# EAGLE schematic schmequencer (EAGLE 9.6.2)

## Sheet 1 of 3
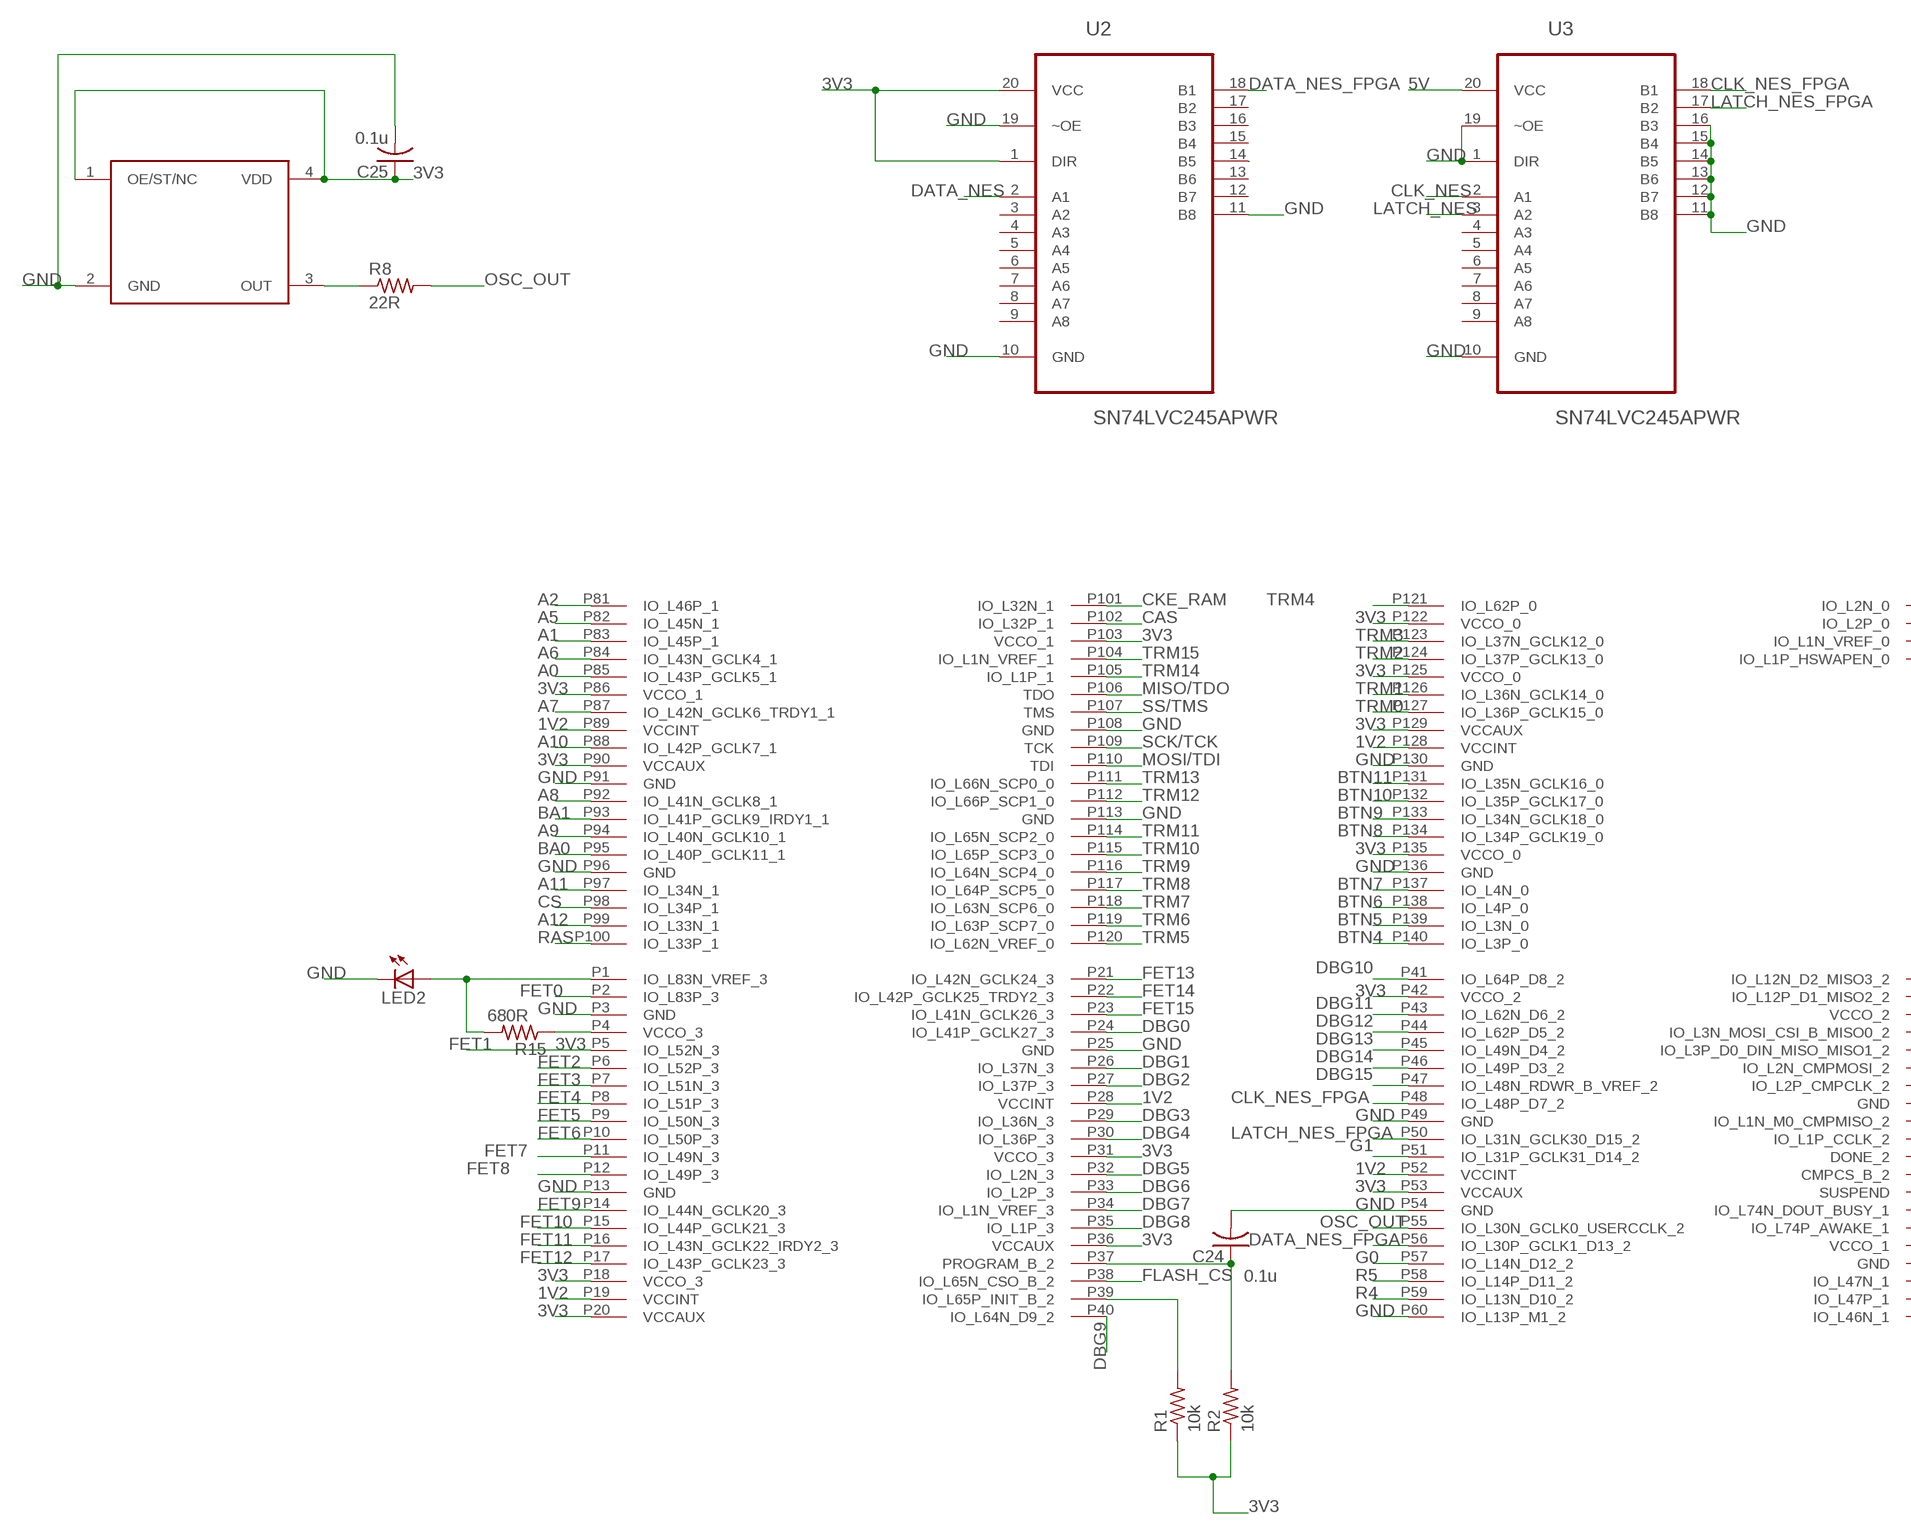
[diagram p0: schematic, sheet 1, part 1 of 2]
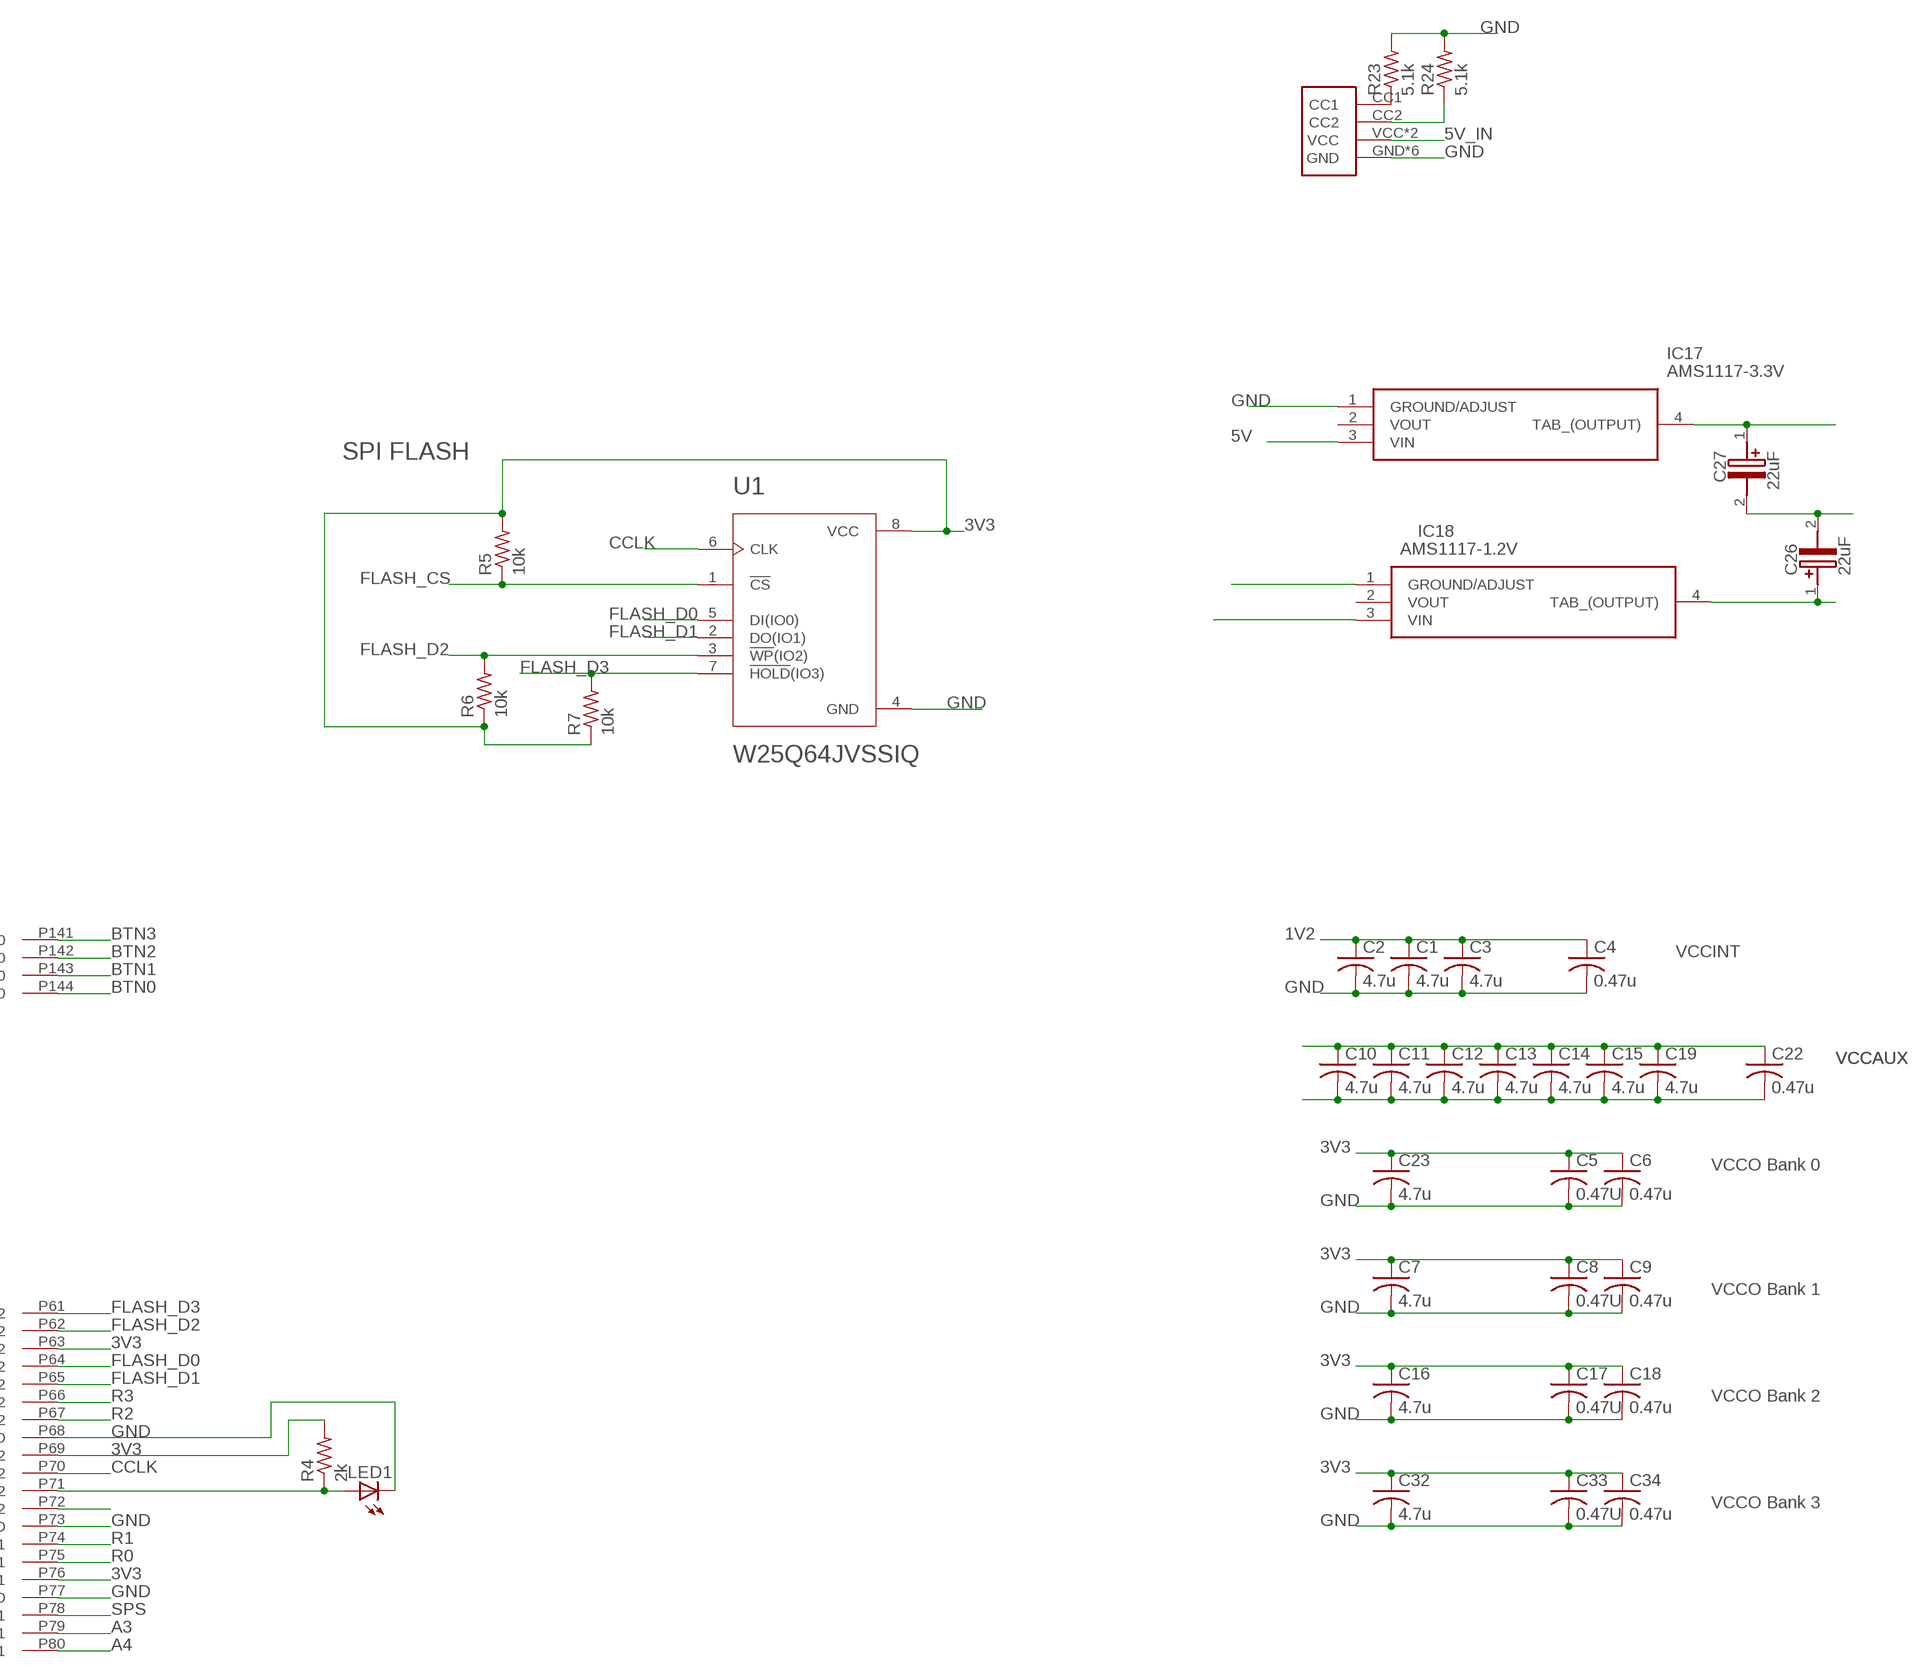
[diagram p1: schematic, sheet 1, part 2 of 2]

### Parts
C1  4.7u  C-USC0603  [C0603]
C2  4.7u  C-USC0603  [C0603]
C3  4.7u  C-USC0603  [C0603]
C4  0.47u  C-USC0603  [C0603]
C5  0.47U  C-USC0603  [C0603]
C6  0.47u  C-USC0603  [C0603]
C7  4.7u  C-USC0603  [C0603]
C8  0.47U  C-USC0603  [C0603]
C9  0.47u  C-USC0603  [C0603]
C10  4.7u  C-USC0603  [C0603]
C11  4.7u  C-USC0603  [C0603]
C12  4.7u  C-USC0603  [C0603]
C13  4.7u  C-USC0603  [C0603]
C14  4.7u  C-USC0603  [C0603]
C15  4.7u  C-USC0603  [C0603]
C16  4.7u  C-USC0603  [C0603]
C17  0.47U  C-USC0603  [C0603]
C18  0.47u  C-USC0603  [C0603]
C19  4.7u  C-USC0603  [C0603]
C22  0.47u  C-USC0603  [C0603]
C23  4.7u  C-USC0603  [C0603]
C24  0.1u  C-USC0603  [C0603]
C25  0.1u  C-USC0603  [C0603]
C26  22uF  293D106X9016A2TE3  [CAPPM3216X180N]
C27  22uF  293D106X9016A2TE3  [CAPPM3216X180N]
C32  4.7u  C-USC0603  [C0603]
C33  0.47U  C-USC0603  [C0603]
C34  0.47u  C-USC0603  [C0603]
IC17  AMS1117-3.3V  [SOT229P700X180-4N]
IC18  AMS1117-1.2V  AMS1117-3.3V  [SOT229P700X180-4N]
LED1  LEDCHIP-LED0603  [CHIP-LED0603]
LED2  LEDCHIP-LED0603  [CHIP-LED0603]
R1  10k  R-US_R0603  [R0603]
R2  10k  R-US_R0603  [R0603]
R4  2k  R-US_R0603  [R0603]
R5  10k  R-US_R0603  [R0603]
R6  10k  R-US_R0603  [R0603]
R7  10k  R-US_R0603  [R0603]
R8  22R  R-US_R0603  [R0603]
R15  680R  R-US_R0603  [R0603]
R23  5.1k  R-US_R0603  [R0603]
R24  5.1k  R-US_R0603  [R0603]
U1  W25Q64JVSSIQ  W25Q64BVSSIG  [SOIC127P790X216-8N]
U2  SN74LVC245APWR  [SOP65P640X120-20N]
U3  SN74LVC245APWR  [SOP65P640X120-20N]
U$1  O50327425MEDH4MI  SIT1602BI-82-33E-75.250000YO50327425MEDH4MI  [OSC_ECS-3518-640-B-TR]
U$2  XC6SLX9-2TQG144C  [TQ144]
U$7  POWER_USBC  [USB-C]

### Nets
1V1: C26.1(+) IC18.4(TAB_(OUTPUT))
1V2: C1.1 C2.1 C3.1 C4.1 U$2.P19(VCCINT) U$2.P28(VCCINT) U$2.P52(VCCINT) U$2.P89(VCCINT) U$2.P128(VCCINT)
3V1: C27.1(+) IC17.4(TAB_(OUTPUT))
3V3: C5.1 C6.1 C7.1 C8.1 C9.1 C10.1 C11.1 C12.1 C13.1 C14.1 C15.1 C16.1 C17.1 C18.1 C19.1 C22.1 C23.1 C25.1 C32.1 C33.1 C34.1 R1.1 R2.1 R4.2 R5.2 R6.1 R7.1 R15.1 U1.8(VCC) U2.1(DIR) U2.20(VCC) U$1.1(OE/ST/NC) U$1.4(VDD) U$2.P4(VCCO_3) U$2.P18(VCCO_3) U$2.P20(VCCAUX) U$2.P31(VCCO_3) U$2.P36(VCCAUX) U$2.P42(VCCO_2) U$2.P53(VCCAUX) U$2.P63(VCCO_2) U$2.P69(IO_L1N_M0_CMPMISO_2) U$2.P76(VCCO_1) U$2.P86(VCCO_1) U$2.P90(VCCAUX) U$2.P103(VCCO_1) U$2.P122(VCCO_0) U$2.P125(VCCO_0) U$2.P129(VCCAUX) U$2.P135(VCCO_0) ; also sheet 2,3
5V: IC17.3(VIN) IC18.3(VIN) U3.20(VCC) ; also sheet 3
5V_IN: U$7.VCC U$7.VCC1(VCC)
A0: U$2.P85(IO_L43P_GCLK5_1)
A1: U$2.P83(IO_L45P_1)
A2: U$2.P81(IO_L46P_1)
A3: U$2.P79(IO_L47P_1)
A4: U$2.P80(IO_L46N_1)
A5: U$2.P82(IO_L45N_1)
A6: U$2.P84(IO_L43N_GCLK4_1)
A7: U$2.P87(IO_L42N_GCLK6_TRDY1_1)
A8: U$2.P92(IO_L41N_GCLK8_1)
A9: U$2.P94(IO_L40N_GCLK10_1)
A10: U$2.P88(IO_L42P_GCLK7_1)
A11: U$2.P97(IO_L34N_1)
A12: U$2.P99(IO_L33N_1)
BA0: U$2.P95(IO_L40P_GCLK11_1)
BA1: U$2.P93(IO_L41P_GCLK9_IRDY1_1)
BTN0: U$2.P144(IO_L1P_HSWAPEN_0) ; also sheet 2
BTN1: U$2.P143(IO_L1N_VREF_0) ; also sheet 2
BTN2: U$2.P142(IO_L2P_0) ; also sheet 2
BTN3: U$2.P141(IO_L2N_0) ; also sheet 2
BTN4: U$2.P140(IO_L3P_0) ; also sheet 2
BTN5: U$2.P139(IO_L3N_0) ; also sheet 2
BTN6: U$2.P138(IO_L4P_0) ; also sheet 2
BTN7: U$2.P137(IO_L4N_0) ; also sheet 2
BTN8: U$2.P134(IO_L34P_GCLK19_0) ; also sheet 2
BTN9: U$2.P133(IO_L34N_GCLK18_0) ; also sheet 2
BTN10: U$2.P132(IO_L35P_GCLK17_0) ; also sheet 2
BTN11: U$2.P131(IO_L35N_GCLK16_0) ; also sheet 2
CAS: U$2.P102(IO_L32P_1)
CCLK: U1.6(CLK) U$2.P70(IO_L1P_CCLK_2)
CKE_RAM: U$2.P101(IO_L32N_1)
CLK_NES: U3.2(A1) ; also sheet 3
CLK_NES_FPGA: U3.18(B1) U$2.P48(IO_L48P_D7_2)
CS: U$2.P98(IO_L34P_1)
DATA_NES: U2.2(A1) ; also sheet 3
DATA_NES_FPGA: U2.18(B1) U$2.P56(IO_L30P_GCLK1_D13_2)
DBG0: U$2.P24(IO_L41P_GCLK27_3) ; also sheet 3
DBG1: U$2.P26(IO_L37N_3) ; also sheet 3
DBG2: U$2.P27(IO_L37P_3) ; also sheet 3
DBG3: U$2.P29(IO_L36N_3) ; also sheet 3
DBG4: U$2.P30(IO_L36P_3) ; also sheet 3
DBG5: U$2.P32(IO_L2N_3) ; also sheet 3
DBG6: U$2.P33(IO_L2P_3) ; also sheet 3
DBG7: U$2.P34(IO_L1N_VREF_3) ; also sheet 3
DBG8: U$2.P35(IO_L1P_3) ; also sheet 3
DBG9: U$2.P40(IO_L64N_D9_2) ; also sheet 3
DBG10: U$2.P41(IO_L64P_D8_2) ; also sheet 3
DBG11: U$2.P43(IO_L62N_D6_2) ; also sheet 3
DBG12: U$2.P44(IO_L62P_D5_2) ; also sheet 3
DBG13: U$2.P45(IO_L49N_D4_2) ; also sheet 3
DBG14: U$2.P46(IO_L49P_D3_2) ; also sheet 3
DBG15: U$2.P47(IO_L48N_RDWR_B_VREF_2) ; also sheet 3
FET0: U$2.P2(IO_L83P_3) ; also sheet 2
FET1: U$2.P5(IO_L52N_3) ; also sheet 2
FET2: U$2.P6(IO_L52P_3) ; also sheet 2
FET3: U$2.P7(IO_L51N_3) ; also sheet 2
FET4: U$2.P8(IO_L51P_3) ; also sheet 2
FET5: U$2.P9(IO_L50N_3) ; also sheet 2
FET6: U$2.P10(IO_L50P_3) ; also sheet 2
FET7: U$2.P11(IO_L49N_3) ; also sheet 2
FET8: U$2.P12(IO_L49P_3) ; also sheet 2
FET9: U$2.P14(IO_L44N_GCLK20_3) ; also sheet 2
FET10: U$2.P15(IO_L44P_GCLK21_3) ; also sheet 2
FET11: U$2.P16(IO_L43N_GCLK22_IRDY2_3) ; also sheet 2
FET12: U$2.P17(IO_L43P_GCLK23_3) ; also sheet 2
FET13: U$2.P21(IO_L42N_GCLK24_3) ; also sheet 2
FET14: U$2.P22(IO_L42P_GCLK25_TRDY2_3) ; also sheet 2
FET15: U$2.P23(IO_L41N_GCLK26_3) ; also sheet 2
FLASH_CS: R5.1 U1.1(!CS) U$2.P38(IO_L65N_CSO_B_2)
FLASH_D0: U1.5(DI(IO0)) U$2.P64(IO_L3N_MOSI_CSI_B_MISO0_2)
FLASH_D1: U1.2(DO(IO1)) U$2.P65(IO_L3P_D0_DIN_MISO_MISO1_2)
FLASH_D2: R6.2 U1.3(!WP!(IO2)) U$2.P62(IO_L12P_D1_MISO2_2)
FLASH_D3: R7.2 U1.7(!HOLD!(IO3)) U$2.P61(IO_L12N_D2_MISO3_2)
G0: U$2.P57(IO_L14N_D12_2)
G1: U$2.P51(IO_L31P_GCLK31_D14_2)
GND: C1.2 C2.2 C3.2 C4.2 C5.2 C6.2 C7.2 C8.2 C9.2 C10.2 C11.2 C12.2 C13.2 C14.2 C15.2 C16.2 C17.2 C18.2 C19.2 C22.2 C23.2 C24.2 C25.2 C26.2(-) C27.2(-) C32.2 C33.2 C34.2 IC17.1(GROUND/ADJUST) IC18.1(GROUND/ADJUST) LED1.C LED2.C R23.2 R24.2 U1.4(GND) U2.10(GND) U2.11(B8) U2.19(~OE) U3.1(DIR) U3.10(GND) U3.11(B8) U3.12(B7) U3.13(B6) U3.14(B5) U3.15(B4) U3.16(B3) U3.19(~OE) U$1.2(GND) U$2.P3(GND) U$2.P13(GND) U$2.P25(GND) U$2.P49(GND) U$2.P54(GND) U$2.P60(IO_L13P_M1_2) U$2.P68(GND) U$2.P73(SUSPEND) U$2.P77(GND) U$2.P91(GND) U$2.P96(GND) U$2.P108(GND) U$2.P113(GND) U$2.P130(GND) U$2.P136(GND) U$7.GND U$7.GND1(GND) U$7.P$7(GND) U$7.P$8(GND) U$7.P$9(GND) U$7.P$10(GND) ; also sheet 2,3
LATCH_NES: U3.3(A2) ; also sheet 3
LATCH_NES_FPGA: U3.17(B2) U$2.P50(IO_L31N_GCLK30_D15_2)
MISO/TDO: U$2.P106(TDO)
MOSI/TDI: U$2.P110(TDI)
N$1: R1.2 U$2.P39(IO_L65P_INIT_B_2)
N$2: C24.1 R2.2 U$2.P37(PROGRAM_B_2)
N$4: R8.1 U$1.3(OUT)
N$5: R23.1 U$7.CC1
N$7: U2.14(B5)
N$8: R24.1 U$7.CC2
N$19: LED1.A R4.1 U$2.P71(DONE_2)
N$20: LED2.A R15.2 U$2.P1(IO_L83N_VREF_3)
N$31: U$2.P72(CMPCS_B_2)
OSC_OUT: R8.2 U$2.P55(IO_L30N_GCLK0_USERCCLK_2)
R0: U$2.P75(IO_L74P_AWAKE_1)
R1: U$2.P74(IO_L74N_DOUT_BUSY_1)
R2: U$2.P67(IO_L2P_CMPCLK_2)
R3: U$2.P66(IO_L2N_CMPMOSI_2)
R4: U$2.P59(IO_L13N_D10_2)
R5: U$2.P58(IO_L14P_D11_2)
RAS: U$2.P100(IO_L33P_1)
SCK/TCK: U$2.P109(TCK)
SPS: U$2.P78(IO_L47N_1)
SS/TMS: U$2.P107(TMS)
TRM0: U$2.P127(IO_L36P_GCLK15_0) ; also sheet 2
TRM1: U$2.P126(IO_L36N_GCLK14_0) ; also sheet 2
TRM2: U$2.P124(IO_L37P_GCLK13_0) ; also sheet 2
TRM3: U$2.P123(IO_L37N_GCLK12_0) ; also sheet 2
TRM4: U$2.P121(IO_L62P_0) ; also sheet 2
TRM5: U$2.P120(IO_L62N_VREF_0) ; also sheet 2
TRM6: U$2.P119(IO_L63P_SCP7_0) ; also sheet 2
TRM7: U$2.P118(IO_L63N_SCP6_0) ; also sheet 2
TRM8: U$2.P117(IO_L64P_SCP5_0) ; also sheet 2
TRM9: U$2.P116(IO_L64N_SCP4_0) ; also sheet 2
TRM10: U$2.P115(IO_L65P_SCP3_0) ; also sheet 2
TRM11: U$2.P114(IO_L65N_SCP2_0) ; also sheet 2
TRM12: U$2.P112(IO_L66P_SCP1_0) ; also sheet 2
TRM13: U$2.P111(IO_L66N_SCP0_0) ; also sheet 2
TRM14: U$2.P105(IO_L1P_1) ; also sheet 2
TRM15: U$2.P104(IO_L1N_VREF_1) ; also sheet 2
Unconnected: IC17.2(VOUT) IC18.2(VOUT) U2.3(A2) U2.4(A3) U2.5(A4) U2.6(A5) U2.7(A6) U2.8(A7) U2.9(A8) U2.12(B7) U2.13(B6) U2.15(B4) U2.16(B3) U2.17(B2) U3.4(A3) U3.5(A4) U3.6(A5) U3.7(A6) U3.8(A7) U3.9(A8)

### Notes on the sheet
- SPI FLASH
- VCCINT
- VCCAUX | VCCAUX
- VCCO Bank 0
- VCCO Bank 1
- VCCO Bank 2
- VCCO Bank 3

## Sheet 2 of 3
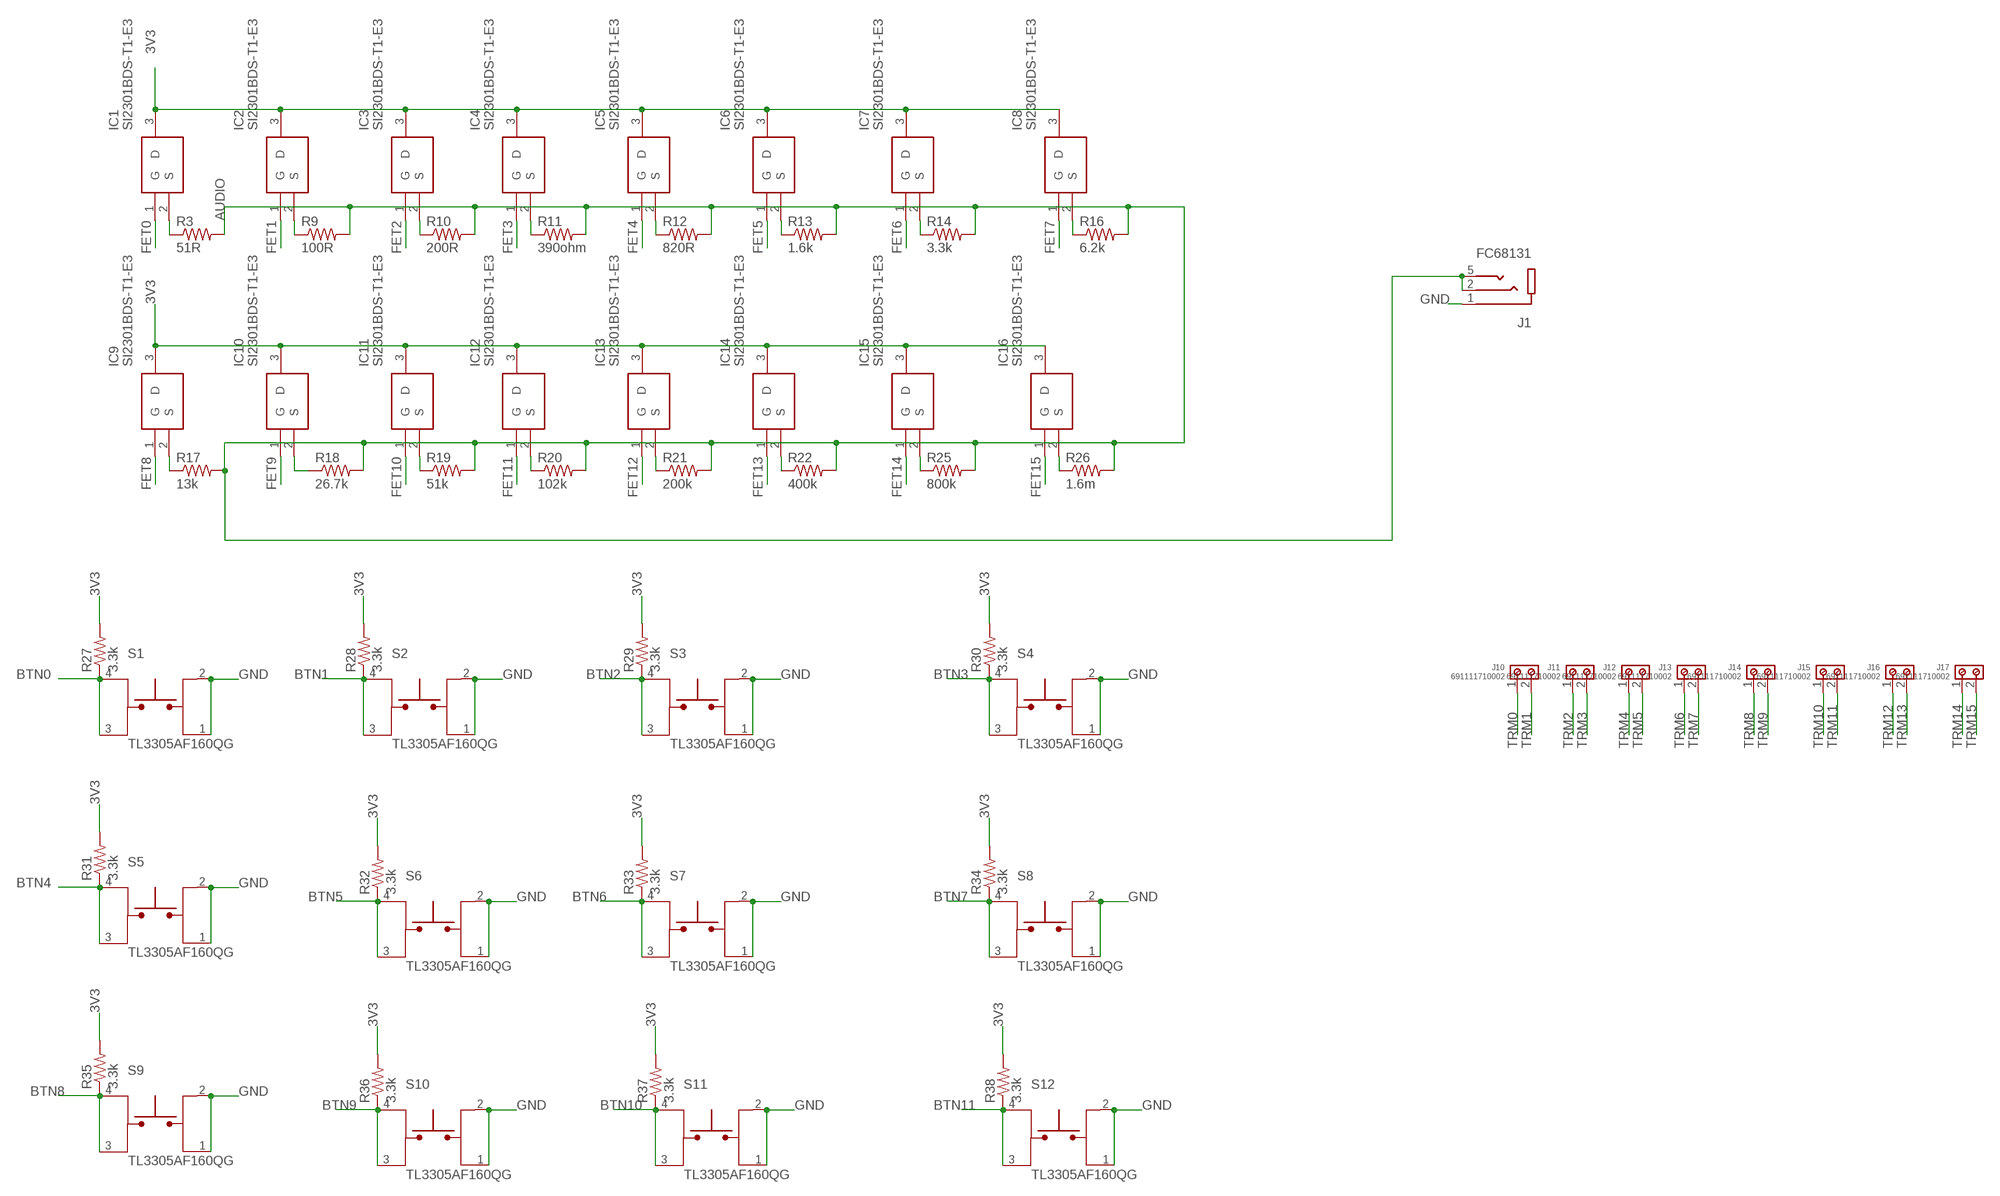
[diagram p2: schematic, sheet 2]

### Parts
IC1  SI2301BDS-T1-E3  [SOT95P237X112-3N]
IC2  SI2301BDS-T1-E3  [SOT95P237X112-3N]
IC3  SI2301BDS-T1-E3  [SOT95P237X112-3N]
IC4  SI2301BDS-T1-E3  [SOT95P237X112-3N]
IC5  SI2301BDS-T1-E3  [SOT95P237X112-3N]
IC6  SI2301BDS-T1-E3  [SOT95P237X112-3N]
IC7  SI2301BDS-T1-E3  [SOT95P237X112-3N]
IC8  SI2301BDS-T1-E3  [SOT95P237X112-3N]
IC9  SI2301BDS-T1-E3  [SOT95P237X112-3N]
IC10  SI2301BDS-T1-E3  [SOT95P237X112-3N]
IC11  SI2301BDS-T1-E3  [SOT95P237X112-3N]
IC12  SI2301BDS-T1-E3  [SOT95P237X112-3N]
IC13  SI2301BDS-T1-E3  [SOT95P237X112-3N]
IC14  SI2301BDS-T1-E3  [SOT95P237X112-3N]
IC15  SI2301BDS-T1-E3  [SOT95P237X112-3N]
IC16  SI2301BDS-T1-E3  [SOT95P237X112-3N]
J1  FC68131  [CLIFF_FC68131]
J10  691111710002  [691111710002]
J11  691111710002  [691111710002]
J12  691111710002  [691111710002]
J13  691111710002  [691111710002]
J14  691111710002  [691111710002]
J15  691111710002  [691111710002]
J16  691111710002  [691111710002]
J17  691111710002  [691111710002]
R3  51R  R-US_R0805  [R0805]
R9  100R  R-US_R0805  [R0805]
R10  200R  R-US_R0805  [R0805]
R11  390ohm  R-US_R0805  [R0805]
R12  820R  R-US_R0805  [R0805]
R13  1.6k  R-US_R0805  [R0805]
R14  3.3k  R-US_R0805  [R0805]
R16  6.2k  R-US_R0805  [R0805]
R17  13k  R-US_R0805  [R0805]
R18  26.7k  R-US_R0805  [R0805]
R19  51k  R-US_R0805  [R0805]
R20  102k  R-US_R0805  [R0805]
R21  200k  R-US_R0805  [R0805]
R22  400k  R-US_R0805  [R0805]
R25  800k  R-US_R0805  [R0805]
R26  1.6m  R-US_R0805  [R0805]
R27  3.3k  R-US_R0805  [R0805]
R28  3.3k  R-US_R0805  [R0805]
R29  3.3k  R-US_R0805  [R0805]
R30  3.3k  R-US_R0805  [R0805]
R31  3.3k  R-US_R0805  [R0805]
R32  3.3k  R-US_R0805  [R0805]
R33  3.3k  R-US_R0805  [R0805]
R34  3.3k  R-US_R0805  [R0805]
R35  3.3k  R-US_R0805  [R0805]
R36  3.3k  R-US_R0805  [R0805]
R37  3.3k  R-US_R0805  [R0805]
R38  3.3k  R-US_R0805  [R0805]
S1  TL3305AF160QG  [SW_TL3305AF160QG]
S2  TL3305AF160QG  [SW_TL3305AF160QG]
S3  TL3305AF160QG  [SW_TL3305AF160QG]
S4  TL3305AF160QG  [SW_TL3305AF160QG]
S5  TL3305AF160QG  [SW_TL3305AF160QG]
S6  TL3305AF160QG  [SW_TL3305AF160QG]
S7  TL3305AF160QG  [SW_TL3305AF160QG]
S8  TL3305AF160QG  [SW_TL3305AF160QG]
S9  TL3305AF160QG  [SW_TL3305AF160QG]
S10  TL3305AF160QG  [SW_TL3305AF160QG]
S11  TL3305AF160QG  [SW_TL3305AF160QG]
S12  TL3305AF160QG  [SW_TL3305AF160QG]

### Nets
3V3: IC1.3(D) IC2.3(D) IC3.3(D) IC4.3(D) IC5.3(D) IC6.3(D) IC7.3(D) IC8.3(D) IC9.3(D) IC10.3(D) IC11.3(D) IC12.3(D) IC13.3(D) IC14.3(D) IC15.3(D) IC16.3(D) R27.2 R28.2 R29.2 R30.2 R31.2 R32.2 R33.2 R34.2 R35.2 R36.2 R37.2 R38.2 ; also sheet 1,3
AUDIO: J1.2(RING) J1.5(TIP) R3.2 R9.2 R10.2 R11.2 R12.2 R13.2 R14.2 R16.2 R17.2 R18.2 R19.2 R20.2 R21.2 R22.2 R25.2 R26.2
BTN0: R27.1 S1.3 S1.4 ; also sheet 1
BTN1: R28.1 S2.3 S2.4 ; also sheet 1
BTN2: R29.1 S3.3 S3.4 ; also sheet 1
BTN3: R30.1 S4.3 S4.4 ; also sheet 1
BTN4: R31.1 S5.3 S5.4 ; also sheet 1
BTN5: R32.1 S6.3 S6.4 ; also sheet 1
BTN6: R33.1 S7.3 S7.4 ; also sheet 1
BTN7: R34.1 S8.3 S8.4 ; also sheet 1
BTN8: R35.1 S9.3 S9.4 ; also sheet 1
BTN9: R36.1 S10.3 S10.4 ; also sheet 1
BTN10: R37.1 S11.3 S11.4 ; also sheet 1
BTN11: R38.1 S12.3 S12.4 ; also sheet 1
FET0: IC1.1(G) ; also sheet 1
FET1: IC2.1(G) ; also sheet 1
FET2: IC3.1(G) ; also sheet 1
FET3: IC4.1(G) ; also sheet 1
FET4: IC5.1(G) ; also sheet 1
FET5: IC6.1(G) ; also sheet 1
FET6: IC7.1(G) ; also sheet 1
FET7: IC8.1(G) ; also sheet 1
FET8: IC9.1(G) ; also sheet 1
FET9: IC10.1(G) ; also sheet 1
FET10: IC11.1(G) ; also sheet 1
FET11: IC12.1(G) ; also sheet 1
FET12: IC13.1(G) ; also sheet 1
FET13: IC14.1(G) ; also sheet 1
FET14: IC15.1(G) ; also sheet 1
FET15: IC16.1(G) ; also sheet 1
GND: J1.1(SLEEVE) S1.1 S1.2 S2.1 S2.2 S3.1 S3.2 S4.1 S4.2 S5.1 S5.2 S6.1 S6.2 S7.1 S7.2 S8.1 S8.2 S9.1 S9.2 S10.1 S10.2 S11.1 S11.2 S12.1 S12.2 ; also sheet 1,3
N$3: IC1.2(S) R3.1
N$15: IC2.2(S) R9.1
N$16: IC3.2(S) R10.1
N$18: IC4.2(S) R11.1
N$22: IC5.2(S) R12.1
N$24: IC6.2(S) R13.1
N$26: IC7.2(S) R14.1
N$28: IC8.2(S) R16.1
N$30: IC9.2(S) R17.1
N$33: IC10.2(S) R18.1
N$35: IC11.2(S) R19.1
N$37: IC12.2(S) R20.1
N$39: IC13.2(S) R21.1
N$41: IC14.2(S) R22.1
N$43: IC15.2(S) R25.1
N$45: IC16.2(S) R26.1
TRM0: J10.1 ; also sheet 1
TRM1: J10.2 ; also sheet 1
TRM2: J11.1 ; also sheet 1
TRM3: J11.2 ; also sheet 1
TRM4: J12.1 ; also sheet 1
TRM5: J12.2 ; also sheet 1
TRM6: J13.1 ; also sheet 1
TRM7: J13.2 ; also sheet 1
TRM8: J14.1 ; also sheet 1
TRM9: J14.2 ; also sheet 1
TRM10: J15.1 ; also sheet 1
TRM11: J15.2 ; also sheet 1
TRM12: J16.1 ; also sheet 1
TRM13: J16.2 ; also sheet 1
TRM14: J17.1 ; also sheet 1
TRM15: J17.2 ; also sheet 1

## Sheet 3 of 3
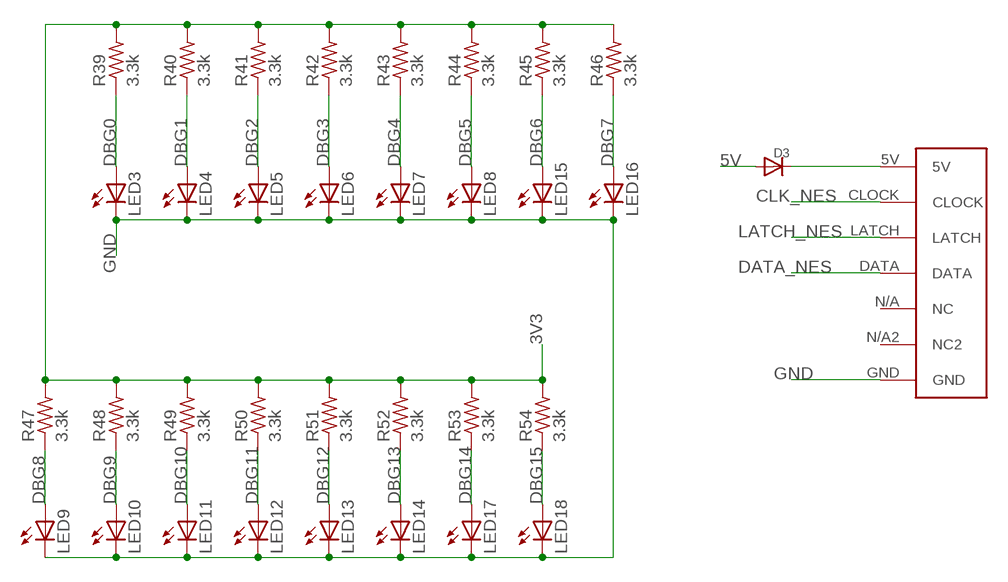
[diagram p3: schematic, sheet 3]

### Parts
D3  DIODESOD-123  [SOD-123]
LED3  LEDCHIP-LED0603  [CHIP-LED0603]
LED4  LEDCHIP-LED0603  [CHIP-LED0603]
LED5  LEDCHIP-LED0603  [CHIP-LED0603]
LED6  LEDCHIP-LED0603  [CHIP-LED0603]
LED7  LEDCHIP-LED0603  [CHIP-LED0603]
LED8  LEDCHIP-LED0603  [CHIP-LED0603]
LED9  LEDCHIP-LED0603  [CHIP-LED0603]
LED10  LEDCHIP-LED0603  [CHIP-LED0603]
LED11  LEDCHIP-LED0603  [CHIP-LED0603]
LED12  LEDCHIP-LED0603  [CHIP-LED0603]
LED13  LEDCHIP-LED0603  [CHIP-LED0603]
LED14  LEDCHIP-LED0603  [CHIP-LED0603]
LED15  LEDCHIP-LED0603  [CHIP-LED0603]
LED16  LEDCHIP-LED0603  [CHIP-LED0603]
LED17  LEDCHIP-LED0603  [CHIP-LED0603]
LED18  LEDCHIP-LED0603  [CHIP-LED0603]
R39  3.3k  R-US_R0805  [R0805]
R40  3.3k  R-US_R0805  [R0805]
R41  3.3k  R-US_R0805  [R0805]
R42  3.3k  R-US_R0805  [R0805]
R43  3.3k  R-US_R0805  [R0805]
R44  3.3k  R-US_R0805  [R0805]
R45  3.3k  R-US_R0805  [R0805]
R46  3.3k  R-US_R0805  [R0805]
R47  3.3k  R-US_R0805  [R0805]
R48  3.3k  R-US_R0805  [R0805]
R49  3.3k  R-US_R0805  [R0805]
R50  3.3k  R-US_R0805  [R0805]
R51  3.3k  R-US_R0805  [R0805]
R52  3.3k  R-US_R0805  [R0805]
R53  3.3k  R-US_R0805  [R0805]
R54  3.3k  R-US_R0805  [R0805]
U$3  SNES_CONT  [SNES_CONT]

### Nets
3V3: R39.2 R40.2 R41.2 R42.2 R43.2 R44.2 R45.2 R46.2 R47.2 R48.2 R49.2 R50.2 R51.2 R52.2 R53.2 R54.2 ; also sheet 1,2
5V: D3.A ; also sheet 1
CLK_NES: U$3.CLOCK ; also sheet 1
DATA_NES: U$3.DATA ; also sheet 1
DBG0: LED3.A R39.1 ; also sheet 1
DBG1: LED4.A R40.1 ; also sheet 1
DBG2: LED5.A R41.1 ; also sheet 1
DBG3: LED6.A R42.1 ; also sheet 1
DBG4: LED7.A R43.1 ; also sheet 1
DBG5: LED8.A R44.1 ; also sheet 1
DBG6: LED15.A R45.1 ; also sheet 1
DBG7: LED16.A R46.1 ; also sheet 1
DBG8: LED9.A R47.1 ; also sheet 1
DBG9: LED10.A R48.1 ; also sheet 1
DBG10: LED11.A R49.1 ; also sheet 1
DBG11: LED12.A R50.1 ; also sheet 1
DBG12: LED13.A R51.1 ; also sheet 1
DBG13: LED14.A R52.1 ; also sheet 1
DBG14: LED17.A R53.1 ; also sheet 1
DBG15: LED18.A R54.1 ; also sheet 1
GND: LED3.C LED4.C LED5.C LED6.C LED7.C LED8.C LED9.C LED10.C LED11.C LED12.C LED13.C LED14.C LED15.C LED16.C LED17.C LED18.C U$3.GND ; also sheet 1,2
LATCH_NES: U$3.LATCH ; also sheet 1
N$12: D3.C U$3.5V
Unconnected: U$3.N/A2(NC2) U$3.N/A(NC)

## Library data of the parts
C1-C19 C22-C25 C32-C34 = rcl:C-US: CAPACITOR, American symbol; SPICEPREFIX: C
C26 C27 = SamacSys_Parts:293D106X9016A2TE3: Capacitor Tantalum SMT 293D 16V 10uF Vishay 10uF SMD Solid MnO2 Tantalum Electrolytic Capacitor, 16 V dc +/-10%, 293D Series Source: Datasheet <https://componentsearchengine.com/Datasheets/1/293D106X9016A2TE3.pdf>; DESCRIPTION: Capacitor Tantalum SMT 293D 16V 10uF Vishay 10uF SMD Solid MnO2 Tantalum Electrolytic Capacitor, 16 V dc +/-10%, 293D Series; HEIGHT: 1.8mm; MANUFACTURER_NAME: Vishay; MANUFACTURER_PART_NUMBER: 293D106X9016A2TE3; MOUSER2_PART_NUMBER: 74-293D106X9016A2TE3; MOUSER2_PRICE-STOCK: https://www.mouser.com/Search/Refine.aspx?Keyword=74-293D106X9016A2TE3
D3 = adafruit:DIODE: Diode SMADIODE - SMA Surface Mount Package 20V 1A Schottky Diode Digikey: 641-1014-6-ND DO-1N4148 - Through Hole Small Current Diode SOD-123 20V 1 A (.5mV Vf) Schottky Diode - Digikey: MBRX120TPMSCT-ND SOD-323 10V 570mA (.38mV Vf, 3ns) Schottky Diode - Digikey: ZLLS410CT-ND SOD-523 30V 30mA Schottky Diode (RB751S-40TE61) - Digikey: RB751S-40TE61CT-ND SOT23-R/W - SOT23 Package (R = Solder Paste/Reflow Ovens, W = Hand-Soldering) BAT54Film 40V 300mA - Digikey: 497-7162-1-ND
IC1-IC16 = SI2301BDS-T1-E3:SI2301BDS-T1-E3: SI2301BDS-T1-E3, P-channel MOSFET Transistor 2.2 A 20 V, 3-Pin SOT-23, TO-236 Source: Datasheet <https://componentsearchengine.com//SI2301BDS-T1-E3.pdf>; DESCRIPTION: SI2301BDS-T1-E3, P-channel MOSFET Transistor 2.2 A 20 V, 3-Pin SOT-23, TO-236; HEIGHT: 1.12mm; MANUFACTURER_NAME: Vishay; MANUFACTURER_PART_NUMBER: SI2301BDS-T1-E3; MOUSER2_PART_NUMBER: 781-SI2301BDS-E3; MOUSER2_PRICE-STOCK: https://www.mouser.com/Search/Refine.aspx?Keyword=781-SI2301BDS-E3
IC17 IC18 = SamacSys_Parts:AMS1117-3.3V: 1A LOW DROPOUT VOLTAGE REGULATOR, SOT-223 Source: Datasheet <http://www.advanced-monolithic.com/pdf/ds1117.pdf>; DESCRIPTION: 1A LOW DROPOUT VOLTAGE REGULATOR, SOT-223; HEIGHT: 1.8mm; MANUFACTURER_NAME: Advanced Monolithic Systems; MANUFACTURER_PART_NUMBER: ams1117-3.3v
J1 = FC68131:FC68131: Stereo Jack, 3.5mm, 3pos, Pcb Check availability <https://pricing.snapeda.com/parts/FC68131/Cliff/view-part?ref=eda>; AVAILABILITY: In Stock; DESCRIPTION: Stereo Jack, 3.5mm, 3pos, Pcb; MF: Cliff; MP: FC68131; PACKAGE: None; PRICE: None
J10-J17 = 691111710002:691111710002: WR-TBL Serie 111 - 5.00 mm Horiz. Entry Modular KIND PROPERTIES Pitch 5 mm MATERIAL PROPERTIES Insulator Material PA66 Insulator Flammability Rating UL94 V-0 Insulator Color Green Contact Material Brass Contact Plating Copper over Zinc Terminal Screw Material Steel Terminal Screw Plating Zinc Wire Guard Material Stainless Steel GENERAL INFORMATION Operating Temperature -40 up to +105 °C Compliance Lead free / RoHS ELECTRICAL PROPERTIES IR cULus 16 A Working Voltage [cULus] 250 V (AC) Withstanding Voltage [cULus] 1500 V (AC) Contact Resistance [cULus] 20 mΩ MECHANICAL PROPERTIES Wire Strip Length 5 up to 6 (mm) Screw M2.5 Solid Wire Section (AWG) 24 to 14 (AWG) Solid Wire Section (Metric) 0.205 to 2.08 (mm²) Stranded Wire Section (AWG) 24 to 14 (AWG) Stranded Wire Section (Metric) 0.205 to 2.08 (mm²) CERTIFICATION UL Approval E315414 PACKAGING PROPERTIES Packaging Box <https://katalog.we-online.com/media/images/v2/o33228v209%20WR-TBL_6911117100xx.jpg> Details see: https://katalog.we-online.com/en/em/TBL_5_00_111_6911117100XX Updated by Ella Wu 2019-11-08 2019(C) Wurth Elektronik Check availability <https://pricing.snapeda.com/parts/691111710002/Wurth%20Electronics/view-part?ref=eda>; AVAILABILITY: In Stock; DESCRIPTION: 2 Position Wire to Board Terminal Block Horizontal with Board 0.197 (5.00mm) Through Hole; MF: Wurth Electronics; MP: 691111710002; PACKAGE: None; PRICE: None; PURCHASE-URL: https://pricing.snapeda.com/search/part/691111710002/?ref=eda
LED1-LED18 = adafruit:LED: LED OSRAM: - CHIPLED LG R971, LG N971, LY N971, LG Q971, LY Q971, LO R971, LY R971 LH N974, LH R974 LS Q976, LO Q976, LY Q976 LO Q996 - Hyper CHIPLED LW Q18S LB Q993, LB Q99A, LB R99A - SideLED LS A670, LO A670, LY A670, LG A670, LP A670 LB A673, LV A673, LT A673, LW A673 LH A674 LY A675 LS A676, LA A676, LO A676, LY A676, LW A676 LS A679, LY A679, LG A679 - Hyper Micro SIDELED® LS Y876, LA Y876, LO Y876, LY Y876 LT Y87S - SmartLED LW L88C, LW L88S LB L89C, LB L89S, LG L890 LS L89K, LO L89K, LY L89K LS L896, LA L896, LO L896, LY L896 - TOPLED LS T670, LO T670, LY T670, LG T670, LP T670 LSG T670, LSP T670, LSY T670, LOP T670, LYG T670 LG T671, LOG T671, LSG T671 LB T673, LV T673, LT T673, LW T673 LH T674 LS T676, LA T676, LO T676, LY T676, LB T676, LH T676, LSB T676, LW T676 LB T67C, LV T67C, LT T67C, LS T67K, LO T67K, LY T67K, LW E67C LS E67B, LA E67B, LO E67B, LY E67B, LB E67C, LV E67C, LT E67C LW T67C LS T679, LY T679, LG T679 LS T770, LO T770, LY T770, LG T770, LP T770 LB T773, LV T773, LT T773, LW T773 LH T774 LS E675, LA E675, LY E675, LS T675 LS T776, LA T776, LO T776, LY T776, LB T776 LHGB T686 LT T68C, LB T68C - Hyper Mini TOPLED® LB M676 - Mini TOPLED Santana® LG M470 LS M47K, LO M47K, LY M47K Source: http://www.osram.convergy.de/
R1-R7 R9-R54 = rcl:R-US_: RESISTOR, American symbol; SPICEPREFIX: R
R8 = resistor:R-US_: RESISTOR, American symbol
S1-S12 = TL3305AF160QG:TL3305AF160QG: Check availability <https://pricing.snapeda.com/parts/TL3305AF160QG/E-Switch/view-part?ref=eda>; AVAILABILITY: In Stock; DESCRIPTION: Tactile Switch SPST-NO Top Actuated Surface Mount; MF: E-Switch; MP: TL3305AF160QG; PACKAGE: None; PRICE: None; PURCHASE-URL: https://pricing.snapeda.com/search/part/TL3305AF160QG/?ref=eda
U1 = W25Q64BVSSIG:W25Q64BVSSIG: IC FLASH 64MBIT 80MHZ 8SOIC; AVAILABILITY: Unavailable; DESCRIPTION: FLASH - NOR Memory IC 64Mb _8M x 8_ SPI 80MHz 8-SOIC; MF: Winbond Electronics; MP: W25Q64BVSSIG; PACKAGE: SOIC-8 Winbond; PRICE: None
U2 U3 = SN74LVC245APWR:SN74LVC245APWR: OCTAL BUS TRANSCEIVER WITH 3-STATE OUTPUTS; DESCRIPTION: Octal Bus Transceiver With 3-State Outputs 20-TSSOP -40 to 125; DIGI-KEY_PART_NUMBER: 296-1233-1-ND; DIGI-KEY_PURCHASE_URL: https://www.digikey.com/product-detail/en/texas-instruments/SN74LVC245APWR/296-1233-1-ND/276501?utm_source=snapeda&utm_medium=aggregator&utm_campaign=symbol; MF: Texas Instruments; MP: SN74LVC245APWR; PACKAGE: TSSOP-20 Texas Instruments
U$1 = SOIC254P1016X440-4N:SIT1602BI-82-33E-75.250000Y
U$2 = XC6SLX9-2TQG144C:XC6SLX9-2TQG144C; AVAILABILITY: Unavailable; DESCRIPTION: FPGA Spartan®-6 LX Family 9152 Cells 45nm _CMOS_ Technology 1.2V 144-Pin TQFP; MF: Xilinx Inc.; MP: XC6SLX9-2TQG144C; PACKAGE: TQFP-144 Xilinx; PRICE: None
U$3 = SNES_CONT:SNES_CONT
U$7 = usbcpower_v1:POWER_USBC